# Altium project Kursov_4_project.PrjPCB
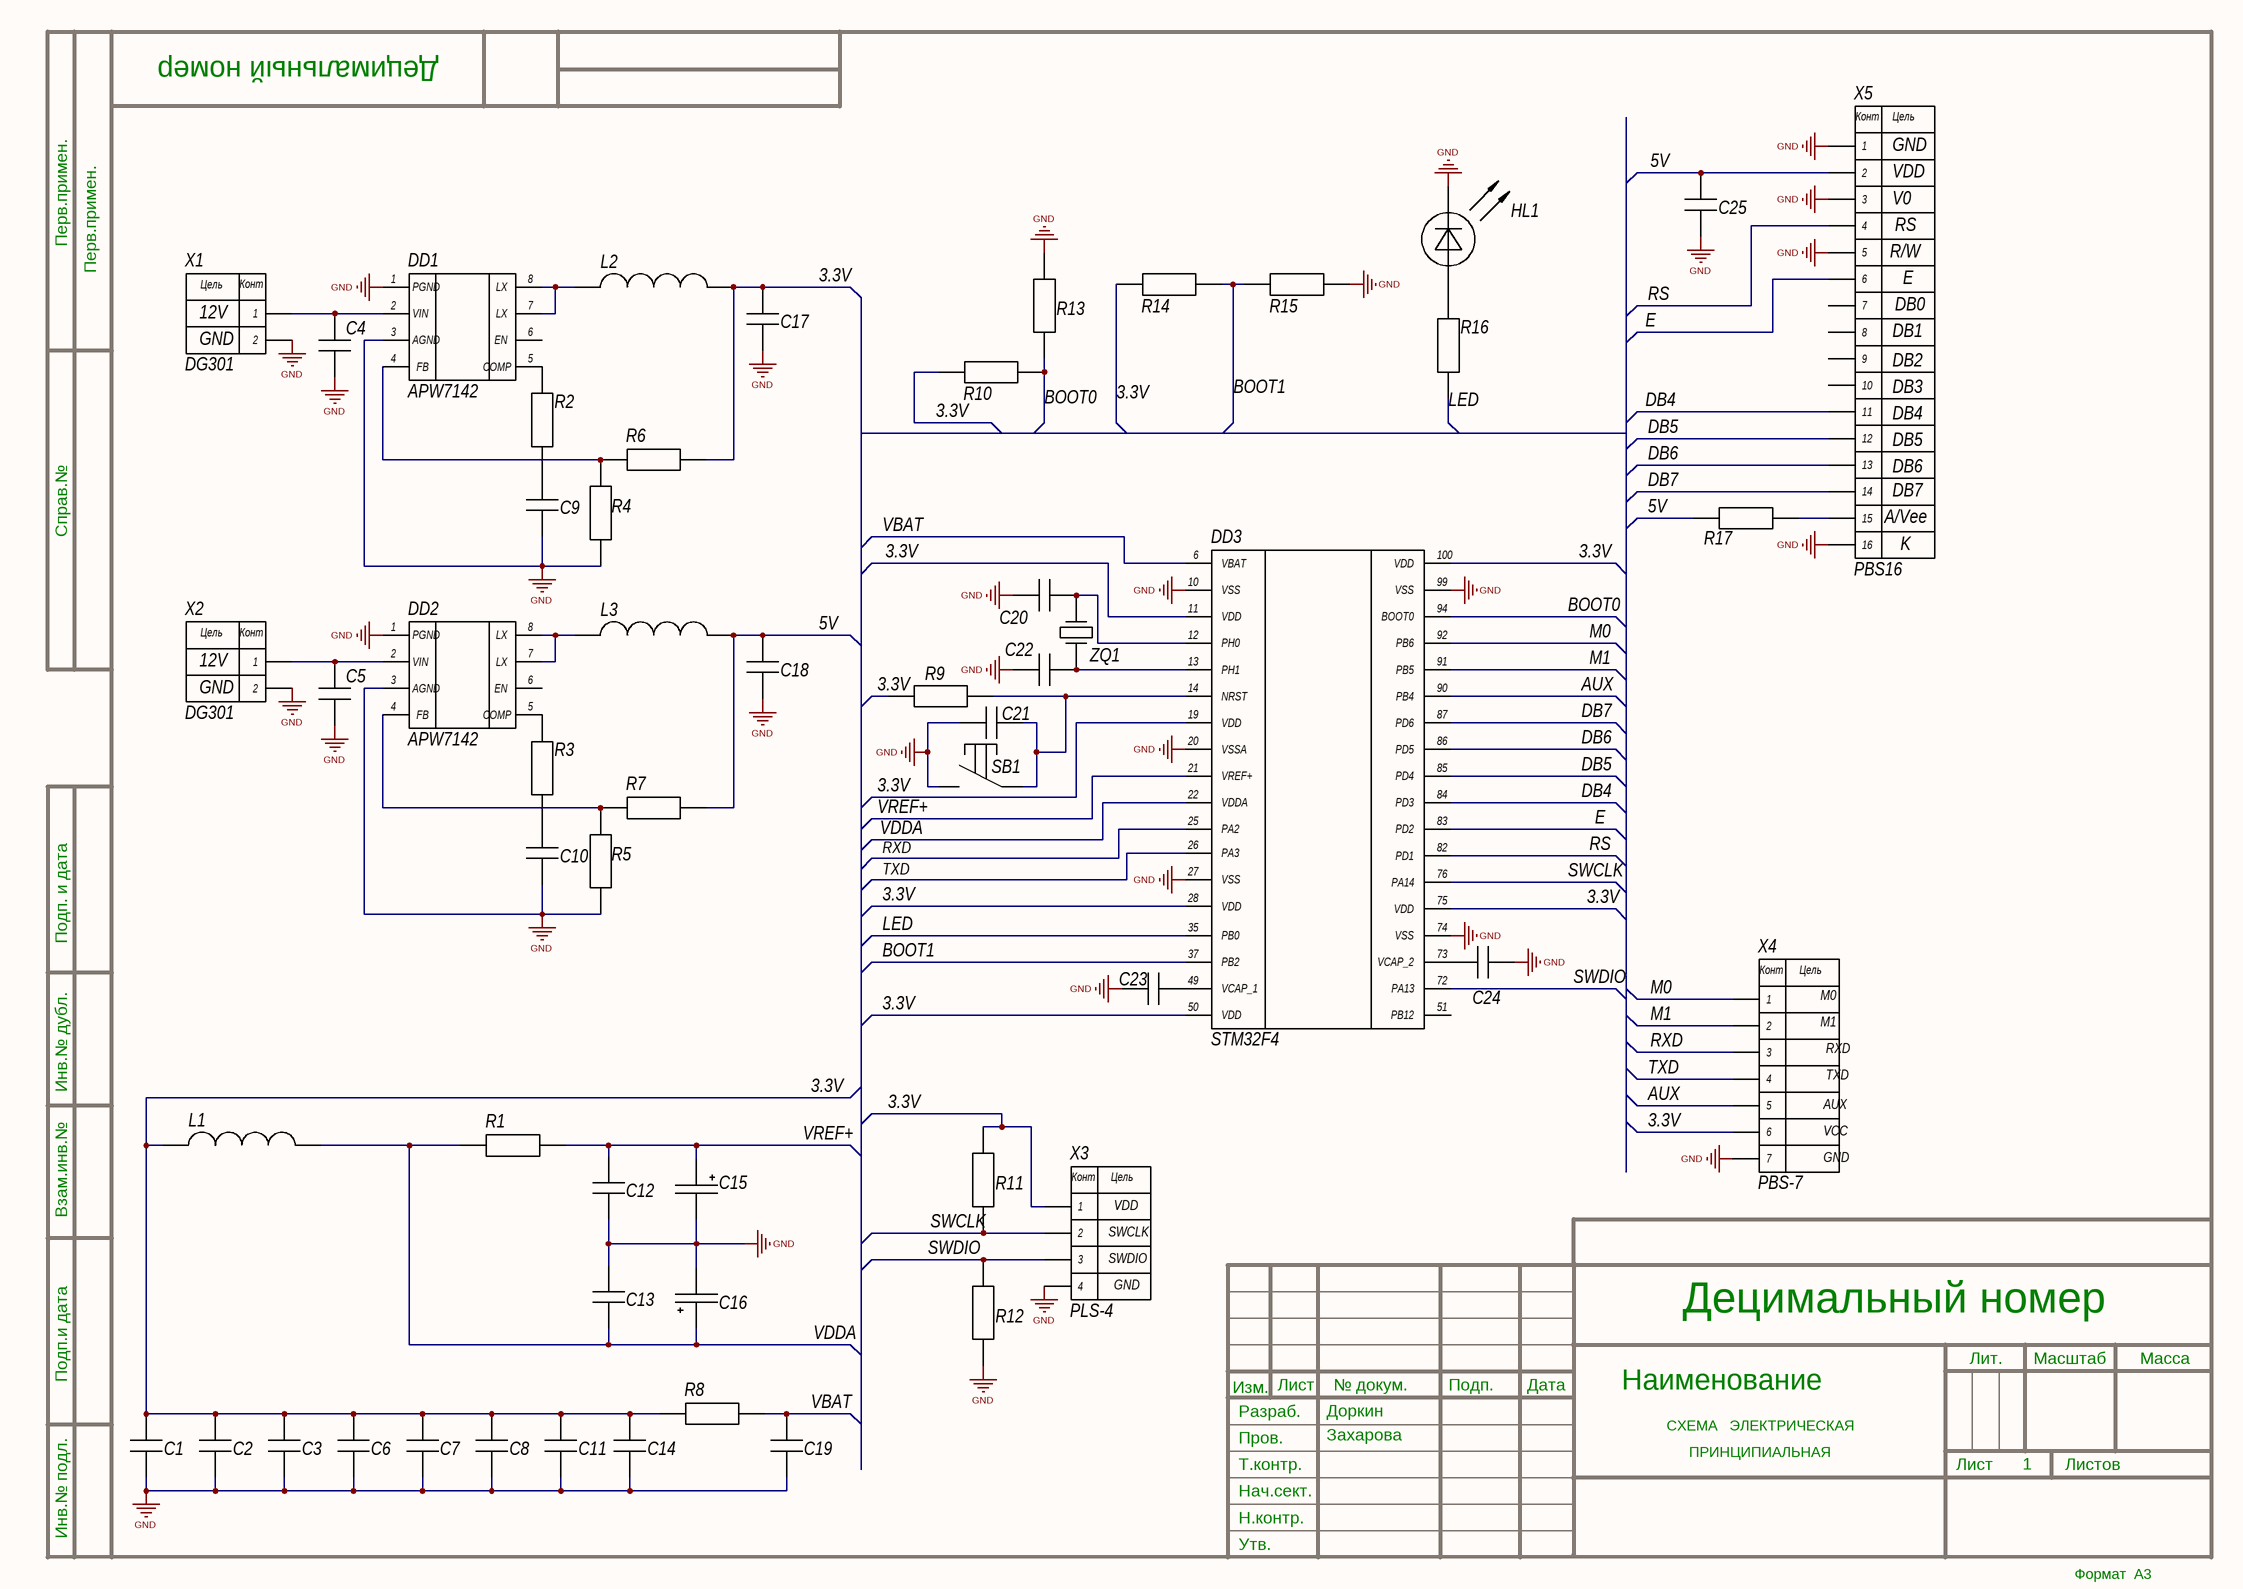
[diagram p0: Sheet2.SchDoc]
1 sheet, 56 parts. Net scope: global (net labels, ports and power ports of the same name join across sheets).
Board file: PCB_plata.PcbDoc

## Sheet Sheet2.SchDoc: Наименование
size 420 x 297 mm; CheckedBy: Захарова; Author: Доркин; SheetNumber: 1; SheetTotal: 1; PageSetup: Record=PageOptions|CenterHorizontal=True|CenterVertical=True|PrintScale=0.98|XCorrection=1.00|YCorrection=1.00|PrintKind=1|BorderSize=5000000|LeftOffset=0|BottomOffset=0|Orientation=2|PaperLength=1000|PaperWidth=1000|Scale=100|PaperSource=7|PrintQuality=-3|MediaType=1|DitherType=10|PrintScaleMode=1|PaperKind=A3|PaperIndex=8; DecimalNumber: Децимальный номер; MainDevice: Перв.примен.; Name: Наименование; DocumentName: Sheet1.SCHDOC

### Parts
C1  100nF  [R1206]  (value not drawn)
C2  C  [R1206]  (value not drawn)
C3  C  [R1206]  (value not drawn)
C4  2.2uF  [R1206]  (value not drawn)
C5  2.2uF  [R1206]  (value not drawn)
C6  C  [R1206]  (value not drawn)
C7  C  [R1206]  (value not drawn)
C8  C  [R1206]  (value not drawn)
C9  1.5nF  [R1206]  (value not drawn)
C10  1.5nF  [R1206]  (value not drawn)
C11  C  [R1206]  (value not drawn)
C12  1uF  [R1206]  (value not drawn)
C13  1uF  [R1206]  (value not drawn)
C14  C  [R1206]  (value not drawn)
C15  100nF  [Rc3216]  (value not drawn)
C16  100nF  [Rc3216]  (value not drawn)
C17  22uF  [R1206]  (value not drawn)
C18  22uF  [R1206]  (value not drawn)
C19  1uF  [R1206]  (value not drawn)
C20  20pF  [R1206]  (value not drawn)
C21  100nF  [R1206]  (value not drawn)
C22  20pF  [R1206]  (value not drawn)
C23  2.2uF  [R1206]  (value not drawn)
C24  2.2uF  [R1206]  (value not drawn)
C25  100nF  [R1206]  (value not drawn)
DD1  APW7142  [APW7142]
DD2  APW7142  [APW7142]
DD3  STM32F4  [STM32F4xx]
HL1  Led  [LED]  (value not drawn)
L1  4.7uH  [R1206]  (value not drawn)
L2  4.7uH  [R1206]  (value not drawn)
L3  6.8uH  [R1206]  (value not drawn)
R1  47  [R1206]  (value not drawn)
R2  10k  [R1206]  (value not drawn)
R3  10k  [R1206]  (value not drawn)
R4  15k  [R1206]  (value not drawn)
R5  12k  [R1206]  (value not drawn)
R6  46.9k  [R1206]  (value not drawn)
R7  63k  [R1206]  (value not drawn)
R8  10k  [R1206]  (value not drawn)
R9  100k  [R1206]  (value not drawn)
R10  100k  [R1206]  (value not drawn)
R11  10k  [R1206]  (value not drawn)
R12  10k  [R1206]  (value not drawn)
R13  510  [R1206]  (value not drawn)
R14  10k  [R1206]  (value not drawn)
R15  510  [R1206]  (value not drawn)
R16  Res  [R1206]  (value not drawn)
R17  100  [R1206]  (value not drawn)
SB1  BUTTON  [RESET_BUTTON]  (value not drawn)
X1  DG301  [DG301]
X2  DG301  [DG301]
X3  PLS-4  [PLS4]
X4  PBS-7  [PBS7]
X5  PBS16  [PBS16]
ZQ1  KR  [HC-49SM]  (value not drawn)

### Nets
GND: C1.1 C2.1 C3.1 C4.2 C5.2 C6.1 C7.1 C8.1 C9.1 C10.1 C11.1 C12.1 C13.2 C14.1 C15.2 C16.2 C17.2 C18.2 C19.1 C20.1 C21.1 C22.1 C23.1 C24.1 C25.1 DD1.1(PGND) DD1.3(AGND) DD2.1(PGND) DD2.3(AGND) DD3.10(VSS) DD3.20(VSSA) DD3.27(VSS) DD3.74(VSS) DD3.99(VSS) HL1.2 R4.1 R5.1 R12.1 R13.2 R15.2 SB1.2 X1.2 X2.2 X3.4 X4.7 X5.1 X5.3 X5.5 X5.16
3.3V: C1.2 C2.2 C3.2 C6.2 C7.2 C8.2 C11.2 C14.2 C17.1 DD3.11(VDD) DD3.19(VDD) DD3.28(VDD) DD3.50(VDD) DD3.75(VDD) DD3.100(VDD) L1.1 L2.2 R6.2 R8.1 R9.1 R10.2 R11.2 R14.1 X3.1 X4.6
5V: C18.1 C25.2 L3.2 R7.2 R17.1 X5.2
AUX: DD3.90(PB4) X4.5
BOOT0: DD3.94(BOOT0) R10.1 R13.1
BOOT1: DD3.37(PB2) R14.2 R15.1
DB4: DD3.84(PD3) X5.11
DB5: DD3.85(PD4) X5.12
DB6: DD3.86(PD5) X5.13
DB7: DD3.87(PD6) X5.14
E: DD3.83(PD2) X5.18(6)
LED: DD3.35(PB0) R16.1
M0: DD3.92(PB6) X4.1
M1: DD3.91(PB5) X4.2
RS: DD3.82(PD1) X5.4
RXD: DD3.25(PA2) X4.3
SWCLK: DD3.76(PA14) R11.1 X3.2
SWDIO: DD3.72(PA13) R12.2 X3.3
TXD: DD3.26(PA3) X4.4
VBAT: C19.2 DD3.6(VBAT) R8.2
VDDA: C13.1 C16.1 DD3.22(VDDA) L1.2 R1.1
VREF+: C12.2 C15.1 DD3.21(VREF+) R1.2
NetC4_1: C4.1 DD1.2(VIN) X1.1
NetC5_1: C5.1 DD2.2(VIN) X2.1
NetC9_2: C9.2 R2.1
NetC10_2: C10.2 R3.1
NetC20_2: C20.2 DD3.12(PH0) ZQ1.2
NetC21_2: C21.2 DD3.14(NRST) R9.2 SB1.1
NetC22_2: C22.2 DD3.13(PH1) ZQ1.1
NetC23_2: C23.2 DD3.49(VCAP_1)
NetC24_2: C24.2 DD3.73(VCAP_2)
NetDD1_4: DD1.4(FB) R4.2 R6.1
NetDD1_5: DD1.5(COMP) R2.2
NetDD1_7: DD1.7(LX) DD1.8(LX) L2.1
NetDD2_4: DD2.4(FB) R5.2 R7.1
NetDD2_5: DD2.5(COMP) R3.2
NetDD2_7: DD2.7(LX) DD2.8(LX) L3.1
NetHL1_1: HL1.1 R16.2
NetR17_2: R17.2 X5.15

Not connected (* = marked no-connect by the designer): DD1 6(EN); DD2 6(EN); DD3 51(PB12); X5 7 8 9 10

### Notes on the sheet
- (near X5) GND
- (near X5) VDD
- (near X5) R/W
- (near X5) V0
- (near X5) RS
- (near X1) 12V
- (near X5) DB0
- (near X5) E
- (near X1) GND
- (near X5) DB1
- (near X5) DB2
- (near X5) DB3
- (near X5) DB4
- (near X5) DB5
- (near X5) A/Vee
- (near X5) DB6
- (near X5) DB7
- (near X5) K
- (near X2) 12V
- (near X2) GND
- (near X4) M0
- (near X4) M1
- (near X4) RXD
- (near X4) VCC
- (near X4) AUX
- (near X4) TXD
- (near X4) GND
- (near X3) SWDIO
- (near X3) SWCLK
- (near X3) VDD
- (near X3) GND
- Перв.примен.
- Справ.№
- Подп. и дата
- Инв.№ дубл.
- Взам.инв.№
- Подп.и дата
- Разраб.
- Изм.
- Лист
- № докум.
- Подп.
- Дата
- Лит.
- Масштаб
- Масса
- Т.контр.
- Пров.
- СХЕМА   ЭЛЕКТРИЧЕСКАЯ
- ПРИНЦИПИАЛЬНАЯ
- Листов
- Инв.№ подл.
- Утв.
- Н.контр.
- Нач.сект.
- Формат  A3
- (in symbol DG301) Цель; Конт
- (in symbol PBS-7) Конт; Цель
- (in symbol PLS-4) Конт; Цель
- (in symbol Wh1602C) Конт; Цель

### Library data of the parts
C1 C4 C5 C9 C10 C12 C13 C17-C25 = C
C15 C16 = C+
L1-L3 = L
R1-R15 R17 = Res
X5 = Wh1602C